# Altium project N6480.PrjPcb
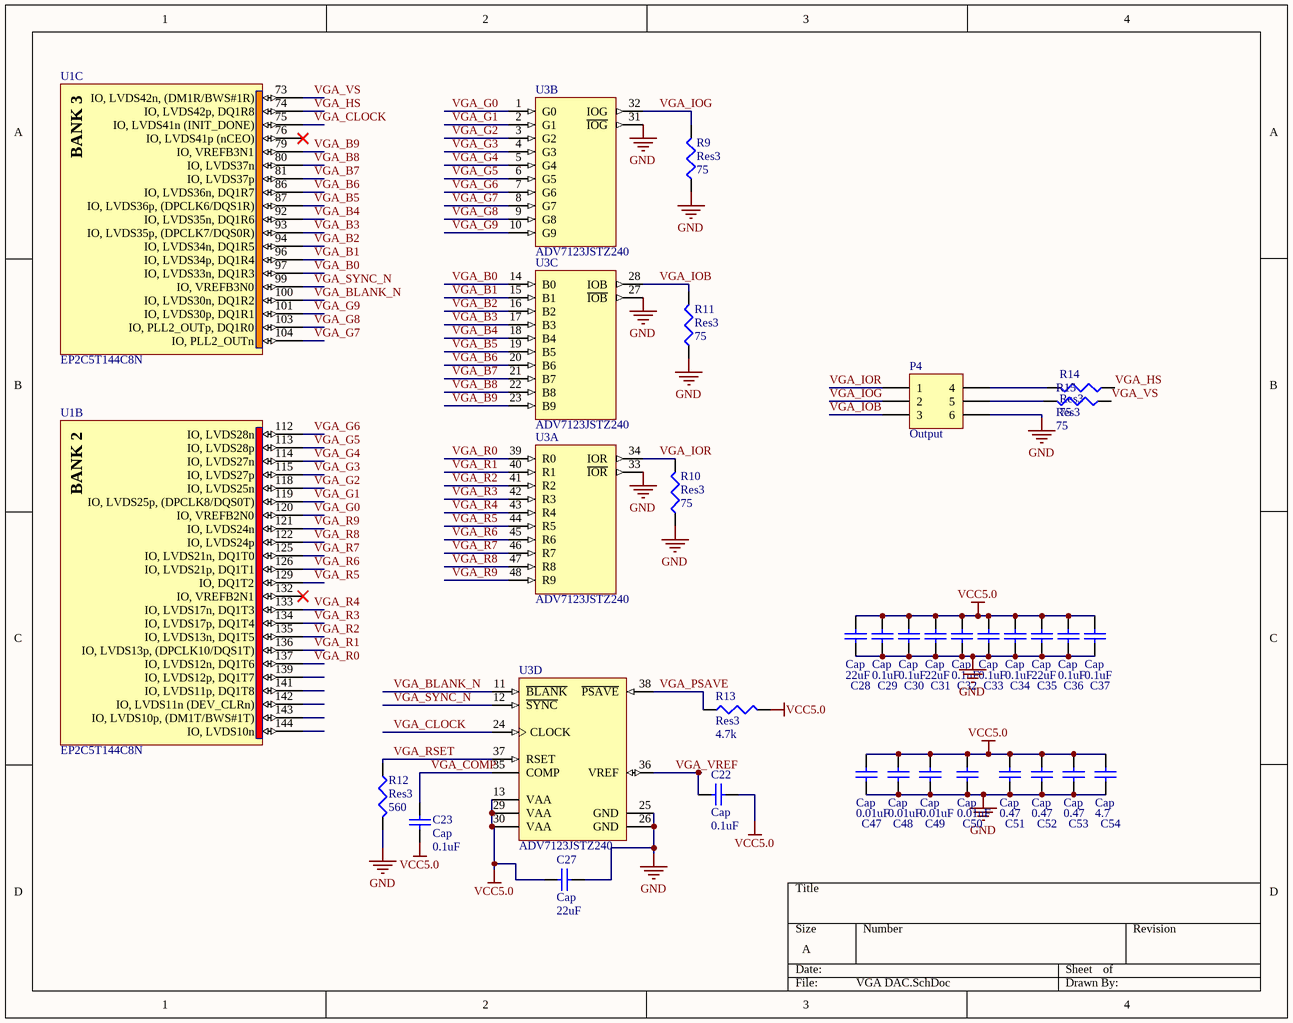
[diagram p0: VGA DAC.SchDoc]
4 sheets, 78 parts. Net scope: global (net labels, ports and power ports of the same name join across sheets).
Board file: N6480.PcbDoc
Sheets:
  VGA DAC.SchDoc
  FPGA Config.SchDoc
  FPGA Inputs.SchDoc
  FPGA Power.SchDoc

## Sheet VGA DAC.SchDoc
size A

### Parts
C22  Cap  value 0.1uF  [1608[0603]]
C23  Cap  value 0.1uF  [1608[0603]]
C27  Cap  value 22uF  [1608[0603]]
C28  Cap  value 22uF  [1608[0603]]
C29  Cap  value 0.1uF  [1608[0603]]
C30  Cap  value 0.1uF  [1608[0603]]
C31  Cap  value 22uF  [1608[0603]]
C32  Cap  value 0.1uF  [1608[0603]]
C33  Cap  value 0.1uF  [1608[0603]]
C34  Cap  value 0.1uF  [1608[0603]]
C35  Cap  value 22uF  [1608[0603]]
C36  Cap  value 0.1uF  [1608[0603]]
C37  Cap  value 0.1uF  [1608[0603]]
C47  Cap  value 0.01uF  [1608[0603]]
C48  Cap  value 0.01uF  [1608[0603]]
C49  Cap  value 0.01uF  [1608[0603]]
C50  Cap  value 0.01uF  [1608[0603]]
C51  Cap  value 0.47  [1608[0603]]
C52  Cap  value 0.47  [1608[0603]]
C53  Cap  value 0.47  [1608[0603]]
C54  Cap  value 4.7  [1608[0603]]
P4  Output  [HDR2X3_CEN]
R9  Res3  value 75  [J1-0603]
R10  Res3  value 75  [J1-0603]
R11  Res3  value 75  [J1-0603]
R12  Res3  value 560  [J1-0603]
R13  Res3  value 4.7k  [J1-0603]
R14  Res3  value 75  [J1-0603]
R15  Res3  value 75  [J1-0603]
U1  EP2C5T144C8N  [TQFP144_N]  (parts B,C of 9)
U3  ADV7123JSTZ240  [ST-48_N]  (parts A,B,C,D of 4)

### Nets
GND: C27.1 C28.2 C29.2 C30.2 C31.2 C32.2 C33.2 C34.2 C35.2 C36.2 C37.2 C47.2 C48.2 C49.2 C50.2 C51.2 C52.2 C53.2 C54.2 P4.6 R9.1 R10.1 R11.1 R12.2 U3.25(GND) U3.26(GND) U3.27(~{IOB}) U3.31(~{IOG}) U3.33(~{IOR})
VCC5.0: C22.1 C23.2 C27.2 C28.1 C29.1 C30.1 C31.1 C32.1 C33.1 C34.1 C35.1 C36.1 C37.1 C47.1 C48.1 C49.1 C50.1 C51.1 C52.1 C53.1 C54.1 R13.2 U3.13(VAA) U3.29(VAA) U3.30(VAA)
VGA_B0: U1.97(IO,_LVDS33n,_DQ1R3) U3.14(B0)
VGA_B1: U1.96(IO,_LVDS34p,_DQ1R4) U3.15(B1)
VGA_B2: U1.94(IO,_LVDS34n,_DQ1R5) U3.16(B2)
VGA_B3: U1.93(IO,_LVDS35p,_(DPCLK7/DQS0R)) U3.17(B3)
VGA_B4: U1.92(IO,_LVDS35n,_DQ1R6) U3.18(B4)
VGA_B5: U1.87(IO,_LVDS36p,_(DPCLK6/DQS1R)) U3.19(B5)
VGA_B6: U1.86(IO,_LVDS36n,_DQ1R7) U3.20(B6)
VGA_B7: U1.81(IO,_LVDS37p) U3.21(B7)
VGA_B8: U1.80(IO,_LVDS37n) U3.22(B8)
VGA_B9: U1.79(IO,_VREFB3N1) U3.23(B9)
VGA_BLANK_N: U1.100(IO,_LVDS30n,_DQ1R2) U3.11(~{BLANK})
VGA_CLOCK: U1.75(IO,_LVDS41n_(INIT_DONE)) U3.24(CLOCK)
VGA_COMP: C23.1 U3.35(COMP)
VGA_G0: U1.120(IO,_VREFB2N0) U3.1(G0)
VGA_G1: U1.119(IO,_LVDS25p,_(DPCLK8/DQS0T)) U3.2(G1)
VGA_G2: U1.118(IO,_LVDS25n) U3.3(G2)
VGA_G3: U1.115(IO,_LVDS27p) U3.4(G3)
VGA_G4: U1.114(IO,_LVDS27n) U3.5(G4)
VGA_G5: U1.113(IO,_LVDS28p) U3.6(G5)
VGA_G6: U1.112(IO,_LVDS28n) U3.7(G6)
VGA_G7: U1.104(IO,_PLL2_OUTn) U3.8(G7)
VGA_G8: U1.103(IO,_PLL2_OUTp,_DQ1R0) U3.9(G8)
VGA_G9: U1.101(IO,_LVDS30p,_DQ1R1) U3.10(G9)
VGA_HS: R14.1 U1.74(IO,_LVDS42p,_DQ1R8)
VGA_IOB: P4.3 R11.2 U3.28(IOB)
VGA_IOG: P4.2 R9.2 U3.32(IOG)
VGA_IOR: P4.1 R10.2 U3.34(IOR)
VGA_PSAVE: R13.1 U3.38(~{PSAVE})
VGA_R0: U1.137(IO,_LVDS12n,_DQ1T6) U3.39(R0)
VGA_R1: U1.136(IO,_LVDS13p,_(DPCLK10/DQS1T)) U3.40(R1)
VGA_R2: U1.135(IO,_LVDS13n,_DQ1T5) U3.41(R2)
VGA_R3: U1.134(IO,_LVDS17p,_DQ1T4) U3.42(R3)
VGA_R4: U1.133(IO,_LVDS17n,_DQ1T3) U3.43(R4)
VGA_R5: U1.129(IO,_DQ1T2) U3.44(R5)
VGA_R6: U1.126(IO,_LVDS21p,_DQ1T1) U3.45(R6)
VGA_R7: U1.125(IO,_LVDS21n,_DQ1T0) U3.46(R7)
VGA_R8: U1.122(IO,_LVDS24p) U3.47(R8)
VGA_R9: U1.121(IO,_LVDS24n) U3.48(R9)
VGA_RSET: R12.1 U3.37(RSET)
VGA_SYNC_N: U1.99(IO,_VREFB3N0) U3.12(~{SYNC})
VGA_VREF: C22.2 U3.36(VREF)
VGA_VS: R15.1 U1.73(IO,_LVDS42n,_(DM1R/BWS#1R))
NetP4_4: P4.4 R14.2
NetP4_5: P4.5 R15.2

Not connected (* = marked no-connect by the designer): U1 76(IO,_LVDS41p_(nCEO))* 132(IO,_VREFB2N1)* 139(IO,_LVDS12p,_DQ1T7) 141(IO,_LVDS11p,_DQ1T8) 142(IO,_LVDS11n_(DEV_CLRn)) 143(IO,_LVDS10p,_(DM1T/BWS#1T)) 144(IO,_LVDS10n)

### Notes on the sheet
- (in symbol EP2C5T144C8N, part B) BANK 2
- (in symbol EP2C5T144C8N, part C) BANK 3

### Library data of the parts
C22 C23 C27-C37 C47-C54 = Cap Semi: Capacitor (Semiconductor SIM Model); Published: 8-Jun-2000; LatestRevisionDate: 29-May-2009; LatestRevisionNote: IPC-7351 Footprint Added.; PackageReference: C1206; Publisher: Altium Limited; PackageDescription: Chip Capacitor
P4 = Header 3X2A: Header, 3-Pin, Dual row; LatestRevisionDate: 17-Jul-2002; LatestRevisionNote: Re-released for DXP Platform.; Publisher: Altium Limited
R9-R15 = Res3: Resistor; Published: 8-Jun-2000; LatestRevisionDate: 29-May-2009; LatestRevisionNote: IPC-7351 Footprint Added.; PackageReference: J1-0603; Publisher: Altium Limited; PackageDescription: Chip Resistor
U1 = EP2C5T144C8N: Cyclone II Family, 1.2V FPGA, 89 I/O Pins, 2 PLLs, 144-Pin TQFP, Speed Grade 8, Commercial Grade, Pb-Free; Published: 4-Mar-2005; LatestRevisionDate: 14-May-2007; LatestRevisionNote: DATA0 pin is now INPUT.; DatasheetVersion: ver3.3, Feb-2008; PackageVersion: ver15.4, Dec-2008; PackageReference: TQFP144; Publisher: Altium Limited; PackageDescription: 144-Pin Plastic Thin Quad Flat Pack (TQFP144) - Wire Bond; Supplier 1: Digi-Key; Supplier Part Number 1: 544-1665-ND; Supplier 2: Farnell; Supplier Part Number 2: 1662263; Supplier 3: Farnell; Supplier Part Number 3: 1453497; Code_JEDEC: MS-026-BFB; ComponentLink1Description: Manufacturer Link; ComponentLink1URL: http://www.altera.com/products/devices/cyclone2/cy2-index.jsp; ComponentLink2Description: Handbook; ComponentLink2URL: http://www.altera.com/literature/hb/cyc2/cyc2_cii5v1.pdf; ComponentLink3Description: Packaging Specification; ComponentLink3URL: http://www.altera.com/literature/ds/dspkg.pdf
U3 = ADV7123JSTZ240: 3 Channel 10-Bit CMOS High Speed Video Digital-to-Analog Converter, 330 MHz, 0 to 70 degC, ST-48, Pb-Free, Tray; Manufacturer: Analog Devices; # DAC Outputs: 3; Max V+: 5.25V; Op Pwr Diss: 485mW; Resolution (Bits): 10; Settling Time: 15ns; Single Supply: Yes; DatasheetVersion: Rev.D; PackageVersion: revA; PackageReference: ST-48; PackageDescription: 48-Pin Thin Quad Flat Pack 0.5 mm Pitch; Supplier 1: Digi-Key; Supplier Part Number 1: ADV7123JSTZ240-ND; Supplier 2: Farnell; Supplier Part Number 2: 1438732; Supplier 3: Newark; Supplier Part Number 3: 19M8771; Supplier 4: Mouser; Supplier Part Number 4: 584-ADV7123JSTZ240; Generic Part Number: ADV7123; Packing: Tray; RoHS: Y; Mounting Technology: Surface Mount; PartNumber: ADV7123JSTZ240; ComponentLink1Description: Manufacturer URL; ComponentLink1URL: http://www.analog.com/en/index.html; ComponentLink2Description: Datasheet; ComponentLink2URL: http://www.analog.com/static/imported-files/data_sheets/ADV7123.pdf; ComponentLink3Description: Package Specification; ComponentLink3URL: http://www.analog.com/static/imported-files/packages/PKG_PDF/LQFP%28ST%29/ST_48.pdf; ComponentLink4Description: Product URL; ComponentLink4URL: http://www.analog.com/en/digital-to-analog-converters/da-converters/adv7123/products/product.html

## Sheet FPGA Config.SchDoc
size A
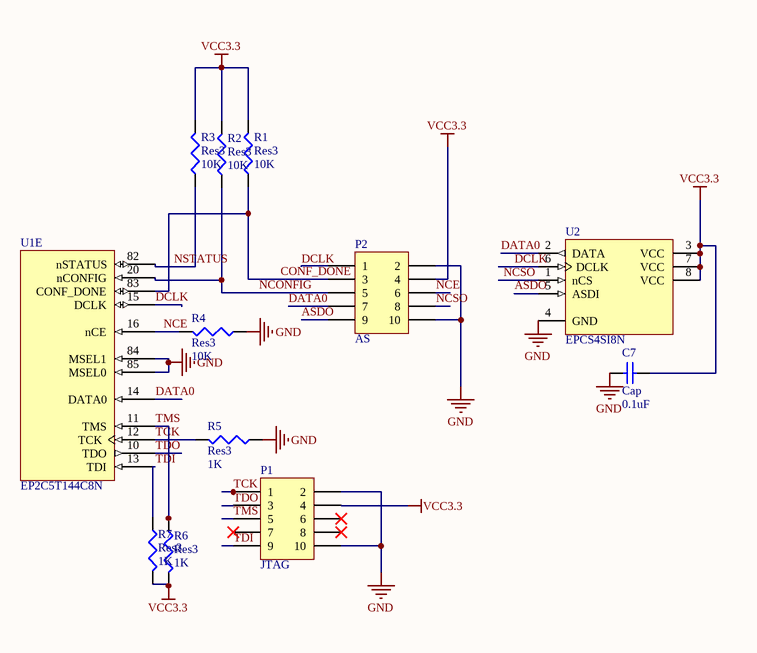
[diagram p1: FPGA Config.SchDoc]

### Parts
C7  Cap  value 0.1uF  [1608[0603]]
P1  JTAG  [HDR2X5]
P2  AS  [HDR2X5]
R1  Res3  value 10K  [J1-0603]
R2  Res3  value 10K  [J1-0603]
R3  Res3  value 10K  [J1-0603]
R4  Res3  value 10K  [J1-0603]
R5  Res3  value 1K  [J1-0603]
R6  Res3  value 1K  [J1-0603]
R7  Res3  value 1K  [J1-0603]
U1  EP2C5T144C8N  [TQFP144_N]  (part E of 9)
U2  EPCS4SI8N  [SOIC8_N]

### Nets
GND: C7.2 P1.2 P1.10 P2.2 P2.10 R4.1 R5.1 U1.84(MSEL1) U1.85(MSEL0) U2.4(GND)
VCC3.3: C7.1 P1.4 P2.4 R1.2 R2.2 R3.2 R6.2 R7.2 U2.3(VCC) U2.7(VCC) U2.8(VCC)
ASDO: P2.9 U2.5(ASDI)
CONF_DONE: P2.3 R1.1 U1.83(CONF_DONE)
DATA0: P2.7 U1.14(DATA0) U2.2(DATA)
DCLK: P2.1 U1.15(DCLK) U2.6(DCLK)
NCE: P2.6 R4.2 U1.16(nCE)
NCONFIG: P2.5 R2.1 U1.20(nCONFIG)
NCSO: P2.8 U2.1(nCS)
NSTATUS: R3.1 U1.82(nSTATUS)
TCK: P1.1 R5.2 U1.12(TCK)
TDI: P1.9 R7.1 U1.13(TDI)
TDO: P1.3 U1.10(TDO)
TMS: P1.5 R6.1 U1.11(TMS)

Not connected (* = marked no-connect by the designer): P1 6* 7* 8*

### Library data of the parts
C7 = Cap Semi: Capacitor (Semiconductor SIM Model); Published: 8-Jun-2000; LatestRevisionDate: 29-May-2009; LatestRevisionNote: IPC-7351 Footprint Added.; PackageReference: C1206; Publisher: Altium Limited; PackageDescription: Chip Capacitor
P1 P2 = Header 5X2: Header, 5-Pin, Dual row; LatestRevisionDate: 17-Jul-2002; LatestRevisionNote: Re-released for DXP Platform.; Publisher: Altium Limited
R1-R7 = Res3: Resistor; Published: 8-Jun-2000; LatestRevisionDate: 29-May-2009; LatestRevisionNote: IPC-7351 Footprint Added.; PackageReference: J1-0603; Publisher: Altium Limited; PackageDescription: Chip Resistor
U1 = EP2C5T144C8N: as U1 on sheet VGA DAC; Published: 4-Mar-2005; LatestRevisionDate: 14-May-2007; LatestRevisionNote: DATA0 pin is now INPUT.; DatasheetVersion: ver3.3, Feb-2008; PackageVersion: ver15.4, Dec-2008; PackageReference: TQFP144; Publisher: Altium Limited; PackageDescription: 144-Pin Plastic Thin Quad Flat Pack (TQFP144) - Wire Bond; Supplier 1: Digi-Key; Supplier Part Number 1: 544-1665-ND; Supplier 2: Farnell; Supplier Part Number 2: 1662263; Supplier 3: Farnell; Supplier Part Number 3: 1453497; Code_JEDEC: MS-026-BFB; ComponentLink1Description: Manufacturer Link; ComponentLink1URL: http://www.altera.com/products/devices/cyclone2/cy2-index.jsp; ComponentLink2Description: Handbook; ComponentLink2URL: http://www.altera.com/literature/hb/cyc2/cyc2_cii5v1.pdf; ComponentLink3Description: Packaging Specification; ComponentLink3URL: http://www.altera.com/literature/ds/dspkg.pdf
U2 = EPCS4SI8N: EPCS4 Series, In-system programmable 3.3V serial configuration device, 8-Pin SOIC, 4-Megabit, Industrial Grade, Pb-Free; Configures: Cyclone II, Stratix II, & Cyclone Devices; Published: 4-Mar-2005; LatestRevisionDate: 13-Apr-2006; LatestRevisionNote: IPC-7351 Footprint Added.; DatasheetVersion: ver2.0, Oct-2003; PackageVersion: ver14.2, Oct-2005; PackageReference: SOIC8; Publisher: Altium Limited; PackageDescription: 8-Pin Small Outline Integrated Circuit Package (SOIC8); Supplier 1: Digi-Key; Supplier Part Number 1: 544-1379-5-ND; Supplier 2: Farnell; Supplier Part Number 2: 1662262; Supplier 3: Farnell; Supplier Part Number 3: 1453496; Code_JEDEC: MS-012-AA; Code_IPC: SOIC127P600-8; ComponentLink1Description: Manufacturer Link; ComponentLink1URL: http://www.altera.com/products/devices/config/cfg-index.html; ComponentLink2Description: Configuration Handbook; ComponentLink2URL: http://www.altera.com/literature/hb/cfg/config_handbook.pdf; ComponentLink3Description: Pinout Specification; ComponentLink3URL: http://www.altera.com/literature/hb/cfg/cyc_c51014.pdf; ComponentLink4Description: Packaging Specification; ComponentLink4URL: http://www.altera.com/literature/ds/dspkg.pdf

## Sheet FPGA Inputs.SchDoc
size A
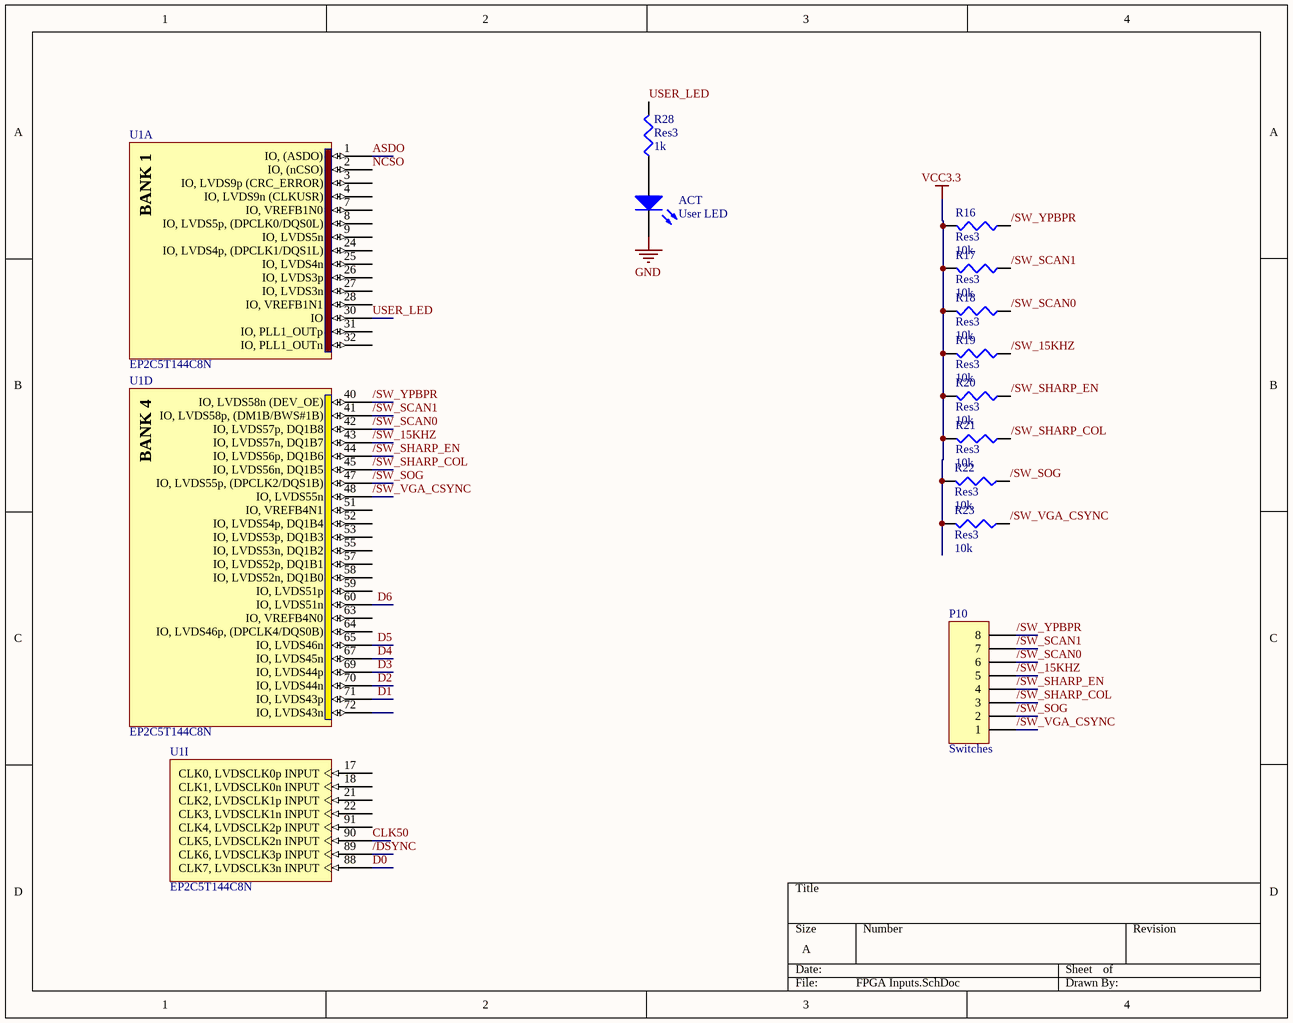
[diagram p2: FPGA Inputs.SchDoc]

### Parts
ACT  User LED  [1608[0603]]
P10  Switches  [HDR1X8]
R16  Res3  value 10k  [J1-0603]
R17  Res3  value 10k  [J1-0603]
R18  Res3  value 10k  [J1-0603]
R19  Res3  value 10k  [J1-0603]
R20  Res3  value 10k  [J1-0603]
R21  Res3  value 10k  [J1-0603]
R22  Res3  value 10k  [J1-0603]
R23  Res3  value 10k  [J1-0603]
R28  Res3  value 1k  [J1-0603]
U1  EP2C5T144C8N  [TQFP144_N]  (parts A,D,I of 9)

### Nets
GND: ACT.2(K)
VCC3.3: R16.2 R17.2 R18.2 R19.2 R20.2 R21.2 R22.2 R23.2
/DSYNC: U1.89(CLK6,_LVDSCLK3p_INPUT)
/SW_15KHZ: P10.5 R19.1 U1.43(IO,_LVDS57n,_DQ1B7)
/SW_SCAN0: P10.6 R18.1 U1.42(IO,_LVDS57p,_DQ1B8)
/SW_SCAN1: P10.7 R17.1 U1.41(IO,_LVDS58p,_(DM1B/BWS#1B))
/SW_SHARP_COL: P10.3 R21.1 U1.45(IO,_LVDS56n,_DQ1B5)
/SW_SHARP_EN: P10.4 R20.1 U1.44(IO,_LVDS56p,_DQ1B6)
/SW_SOG: P10.2 R22.1 U1.47(IO,_LVDS55p,_(DPCLK2/DQS1B))
/SW_VGA_CSYNC: P10.1 R23.1 U1.48(IO,_LVDS55n)
/SW_YPBPR: P10.8 R16.1 U1.40(IO,_LVDS58n_(DEV_OE))
ASDO: U1.1(IO,_(ASDO))
CLK50: U1.90(CLK5,_LVDSCLK2n_INPUT)
D0: U1.88(CLK7,_LVDSCLK3n_INPUT)
D1: U1.71(IO,_LVDS43p)
D2: U1.70(IO,_LVDS44n)
D3: U1.69(IO,_LVDS44p)
D4: U1.67(IO,_LVDS45n)
D5: U1.65(IO,_LVDS46n)
D6: U1.60(IO,_LVDS51n)
NCSO: U1.2(IO,_(nCSO))
USER_LED: R28.2 U1.30(IO)
NetACT_1: ACT.1(A) R28.1

Not connected (* = marked no-connect by the designer): U1 3(IO,_LVDS9p_(CRC_ERROR)) 4(IO,_LVDS9n_(CLKUSR)) 7(IO,_VREFB1N0) 8(IO,_LVDS5p,_(DPCLK0/DQS0L)) 9(IO,_LVDS5n) 17(CLK0,_LVDSCLK0p_INPUT) 18(CLK1,_LVDSCLK0n_INPUT) 21(CLK2,_LVDSCLK1p_INPUT) 22(CLK3,_LVDSCLK1n_INPUT) 24(IO,_LVDS4p,_(DPCLK1/DQS1L)) 25(IO,_LVDS4n) 26(IO,_LVDS3p) 27(IO,_LVDS3n) 28(IO,_VREFB1N1) 31(IO,_PLL1_OUTp) 32(IO,_PLL1_OUTn) 51(IO,_VREFB4N1) 52(IO,_LVDS54p,_DQ1B4) 53(IO,_LVDS53p,_DQ1B3) 55(IO,_LVDS53n,_DQ1B2) 57(IO,_LVDS52p,_DQ1B1) 58(IO,_LVDS52n,_DQ1B0) 59(IO,_LVDS51p) 63(IO,_VREFB4N0) 64(IO,_LVDS46p,_(DPCLK4/DQS0B)) 72(IO,_LVDS43n) 91(CLK4,_LVDSCLK2p_INPUT)

### Notes on the sheet
- (in symbol EP2C5T144C8N, part A) BANK 1
- (in symbol EP2C5T144C8N, part D) BANK 4

### Library data of the parts
ACT = LED2: Typical RED, GREEN, YELLOW, AMBER GaAs LED; Published: 8-Jun-2000; LatestRevisionDate: 17-Jul-2002; LatestRevisionNote: Re-released for DXP Platform.; PackageVersion: Feb-2002; PackageReference: 3.2X1.6X1.1; Publisher: Altium Limited; PackageDescription: SM LED; 2 Flat Leads
P10 = Header 8: Header, 8-Pin; LatestRevisionDate: 17-Jul-2002; LatestRevisionNote: Re-released for DXP Platform.; Publisher: Altium Limited
R16-R23 R28 = Res3: Resistor; Published: 8-Jun-2000; LatestRevisionDate: 29-May-2009; LatestRevisionNote: IPC-7351 Footprint Added.; PackageReference: J1-0603; Publisher: Altium Limited; PackageDescription: Chip Resistor
U1 = EP2C5T144C8N: as U1 on sheet VGA DAC; Published: 4-Mar-2005; LatestRevisionDate: 14-May-2007; LatestRevisionNote: DATA0 pin is now INPUT.; DatasheetVersion: ver3.3, Feb-2008; PackageVersion: ver15.4, Dec-2008; PackageReference: TQFP144; Publisher: Altium Limited; PackageDescription: 144-Pin Plastic Thin Quad Flat Pack (TQFP144) - Wire Bond; Supplier 1: Digi-Key; Supplier Part Number 1: 544-1665-ND; Supplier 2: Farnell; Supplier Part Number 2: 1662263; Supplier 3: Farnell; Supplier Part Number 3: 1453497; Code_JEDEC: MS-026-BFB; ComponentLink1Description: Manufacturer Link; ComponentLink1URL: http://www.altera.com/products/devices/cyclone2/cy2-index.jsp; ComponentLink2Description: Handbook; ComponentLink2URL: http://www.altera.com/literature/hb/cyc2/cyc2_cii5v1.pdf; ComponentLink3Description: Packaging Specification; ComponentLink3URL: http://www.altera.com/literature/ds/dspkg.pdf

## Sheet FPGA Power.SchDoc
size A
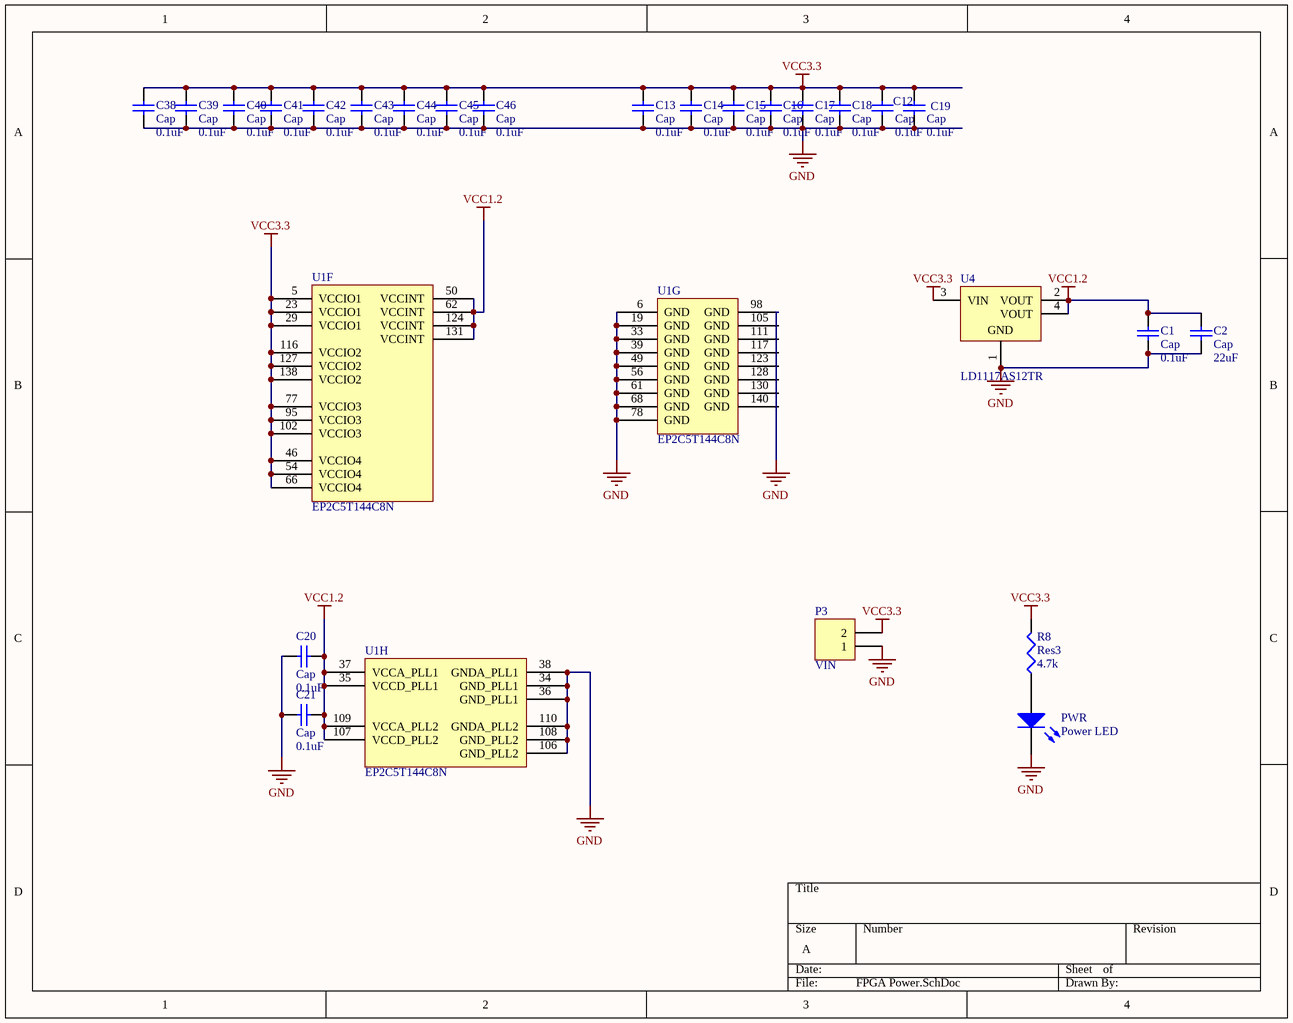
[diagram p3: FPGA Power.SchDoc]

### Parts
C1  Cap  value 0.1uF  [1608[0603]]
C2  Cap  value 22uF  [1608[0603]]
C12  Cap  value 0.1uF  [1608[0603]]
C13  Cap  value 0.1uF  [1608[0603]]
C14  Cap  value 0.1uF  [1608[0603]]
C15  Cap  value 0.1uF  [1608[0603]]
C16  Cap  value 0.1uF  [1608[0603]]
C17  Cap  value 0.1uF  [1608[0603]]
C18  Cap  value 0.1uF  [1608[0603]]
C19  Cap  value 0.1uF  [1608[0603]]
C20  Cap  value 0.1uF  [1608[0603]]
C21  Cap  value 0.1uF  [1608[0603]]
C38  Cap  value 0.1uF  [1608[0603]]
C39  Cap  value 0.1uF  [1608[0603]]
C40  Cap  value 0.1uF  [1608[0603]]
C41  Cap  value 0.1uF  [1608[0603]]
C42  Cap  value 0.1uF  [1608[0603]]
C43  Cap  value 0.1uF  [1608[0603]]
C44  Cap  value 0.1uF  [1608[0603]]
C45  Cap  value 0.1uF  [1608[0603]]
C46  Cap  value 0.1uF  [1608[0603]]
P3  VIN  [HDR1X2]
PWR  Power LED  [1608[0603]]
R8  Res3  value 4.7k  [J1-0603]
U1  EP2C5T144C8N  [TQFP144_N]  (parts F,G,H of 9)
U4  LD1117AS12TR  [SOT223_M]

### Nets
GND: C1.1 C2.1 C12.1 C13.1 C14.1 C15.1 C16.1 C17.1 C18.1 C19.1 C20.1 C21.1 C38.1 C39.1 C40.1 C41.1 C42.1 C43.1 C44.1 C45.1 C46.1 P3.1 PWR.2(K) U1.6(GND) U1.19(GND) U1.33(GND) U1.34(GND_PLL1) U1.36(GND_PLL1) U1.38(GNDA_PLL1) U1.39(GND) U1.49(GND) U1.56(GND) U1.61(GND) U1.68(GND) U1.78(GND) U1.98(GND) U1.106(GND_PLL2) U1.108(GND_PLL2) U1.110(GNDA_PLL2) U4.1(GND)
VCC1.2: C1.2 C2.2 C20.2 C21.2 U1.35(VCCD_PLL1) U1.37(VCCA_PLL1) U1.50(VCCINT) U1.62(VCCINT) U1.107(VCCD_PLL2) U1.109(VCCA_PLL2) U1.124(VCCINT) U1.131(VCCINT) U4.2(VOUT) U4.4(VOUT)
VCC3.3: C12.2 C13.2 C14.2 C15.2 C16.2 C17.2 C18.2 C19.2 C38.2 C39.2 C40.2 C41.2 C42.2 C43.2 C44.2 C45.2 C46.2 P3.2 R8.2 U1.5(VCCIO1) U1.23(VCCIO1) U1.29(VCCIO1) U1.46(VCCIO4) U1.54(VCCIO4) U1.66(VCCIO4) U1.77(VCCIO3) U1.95(VCCIO3) U1.102(VCCIO3) U1.116(VCCIO2) U1.127(VCCIO2) U1.138(VCCIO2) U4.3(VIN)
NetPWR_1: PWR.1(A) R8.1

Not connected (* = marked no-connect by the designer): U1 105(GND) 111(GND) 117(GND) 123(GND) 128(GND) 130(GND) 140(GND)

### Library data of the parts
C1 C2 C12-C21 C38-C46 = Cap Semi: Capacitor (Semiconductor SIM Model); Published: 8-Jun-2000; LatestRevisionDate: 29-May-2009; LatestRevisionNote: IPC-7351 Footprint Added.; PackageReference: C1206; Publisher: Altium Limited; PackageDescription: Chip Capacitor
P3 = Header 2: Header, 2-Pin; LatestRevisionDate: 17-Jul-2002; LatestRevisionNote: Re-released for DXP Platform.; Publisher: Altium Limited
PWR = LED2: as ACT on sheet FPGA Inputs; Published: 8-Jun-2000; LatestRevisionDate: 17-Jul-2002; LatestRevisionNote: Re-released for DXP Platform.; PackageVersion: Feb-2002; PackageReference: 3.2X1.6X1.1; Publisher: Altium Limited; PackageDescription: SM LED; 2 Flat Leads
R8 = Res3: Resistor; Published: 8-Jun-2000; LatestRevisionDate: 29-May-2009; LatestRevisionNote: IPC-7351 Footprint Added.; PackageReference: J1-0603; Publisher: Altium Limited; PackageDescription: Chip Resistor
U1 = EP2C5T144C8N: as U1 on sheet VGA DAC; Published: 4-Mar-2005; LatestRevisionDate: 14-May-2007; LatestRevisionNote: DATA0 pin is now INPUT.; DatasheetVersion: ver3.3, Feb-2008; PackageVersion: ver15.4, Dec-2008; PackageReference: TQFP144; Publisher: Altium Limited; PackageDescription: 144-Pin Plastic Thin Quad Flat Pack (TQFP144) - Wire Bond; Supplier 1: Digi-Key; Supplier Part Number 1: 544-1665-ND; Supplier 2: Farnell; Supplier Part Number 2: 1662263; Supplier 3: Farnell; Supplier Part Number 3: 1453497; Code_JEDEC: MS-026-BFB; ComponentLink1Description: Manufacturer Link; ComponentLink1URL: http://www.altera.com/products/devices/cyclone2/cy2-index.jsp; ComponentLink2Description: Handbook; ComponentLink2URL: http://www.altera.com/literature/hb/cyc2/cyc2_cii5v1.pdf; ComponentLink3Description: Packaging Specification; ComponentLink3URL: http://www.altera.com/literature/ds/dspkg.pdf
U4 = LD1117AS12TR: 1A, Low Drop Positive Voltage Regulator, 1.2V, 4-Pin SOT-223, Tape and Reel; DatasheetVersion: Dec-2011; PackageVersion: 2010; PackageReference: SOT-223; PackageDescription: 4-Pin SOT-223 Package, 6.5 x 3.5 mm Body, 2.3 mm Pitch, 7 mm Lead Span; PartNumber: LD1117AS12TR; ComponentLink1Description: Manufacturer URL; ComponentLink1URL: http://www.st.com; ComponentLink2Description: Datasheet; ComponentLink2URL: http://www.st.com/internet/com/TECHNICAL_RESOURCES/TECHNICAL_LITERATURE/DATASHEET/CD00002116.pdf

## Nets that join several sheets
GND: VGA DAC (29 pins), FPGA Config (10 pins), FPGA Inputs (ACT.2), FPGA Power (40 pins)
VCC3.3: FPGA Config (11 pins), FPGA Inputs (8 pins), FPGA Power (32 pins)
ASDO: FPGA Config (P2.9 U2.5), FPGA Inputs (U1.1)
NCSO: FPGA Config (P2.8 U2.1), FPGA Inputs (U1.2)